# Altium schematic sheet TEST-MODULE.SchDoc
size A4
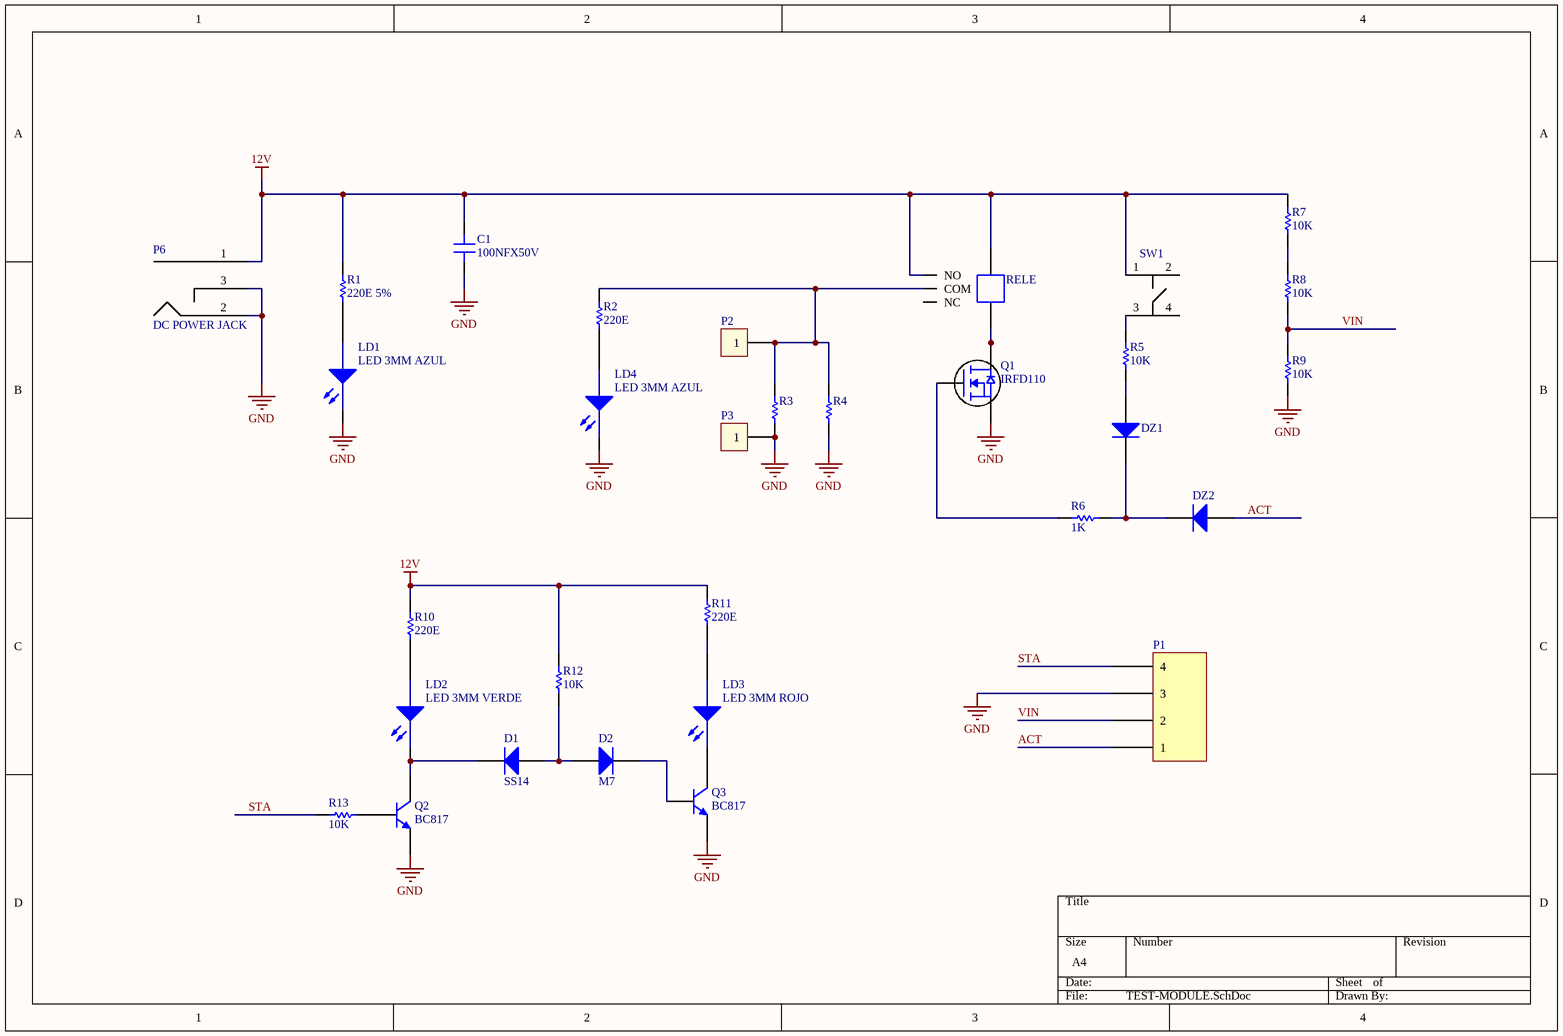
[diagram p0: TEST-MODULE.SchDoc]

## Parts
C1  100NFX50V  [CAP.SMD.0805]
D1  SS14  [Diode-SMD-SMA]
D2  M7  [Diode-SMD-SMA]
DZ1  M7 DIODO 1A 1000V SMD-SMA (1N4007) XYG  [Diode-SMD-SMA]  (value not drawn)
DZ2  M7 DIODO 1A 1000V SMD-SMA (1N4007) XYG  [Diode-SMD-SMA]  (value not drawn)
LD1  LED 3MM AZUL  [LED 3MM AZUL]
LD2  LED 3MM VERDE  [LED 3MM VERDE]
LD3  LED 3MM ROJO  [LED 3MM ROJO]
LD4  LED 3MM AZUL  [LED 3MM AZUL]
P1  CONECTOR PWXXS MA-04 VERTICAL P=3.96MM PW0  [CONECTOR PWXXS MA-04 VERTICAL P=3.96MM]  (value not drawn)
P2  IDC-MA-THT-1X1-P2.54MM-L11  [IDC-MA-THT-1X1-P2.54MM-L11]  (value not drawn)
P3  IDC-MA-THT-1X1-P2.54MM-L11  [IDC-MA-THT-1X1-P2.54MM-L11]  (value not drawn)
P6  DC POWER JACK  [VAR-DC-JACK]
Q1  IRFD110  [TRA-IRFD110]
Q2  BC817  [NPN.SMD.SOT23]
Q3  BC817  [NPN.SMD.SOT23]
R1  220E 5%  [RES.SMD.221]
R2  220E  [RES.SMD.221]
R3  Resistencia Ceramica 15E 5% 15W SE15 RES.CEM  [RES-CERAMICA-15W]  (value not drawn)
R4  Resistencia Ceramica 15E 5% 15W SE15 RES.CEM  [RES-CERAMICA-15W]  (value not drawn)
R5  10K  [RES.SMD.103]
R6  1K  [RES.SMD.102]
R7  10K  [RES.SMD.103]
R8  10K  [RES.SMD.103]
R9  10K  [RES.SMD.103]
R10  220E  [RES.SMD.221]
R11  220E  [RES.SMD.221]
R12  10K  [RES.SMD.103]
R13  10K  [RES.SMD.103]
RELE  Relay simple inversor 5V 10A  [VAR-RELE-5V10A]  (value not drawn)
SW1  TACT-SWITCH  [TACT-SWITCH-THT-4C-06X06-4.3MM]  (value not drawn)

## Nets
12V: C1.2 P6.1 R1.2 R7.2 R10.2 R11.2 R12.2 RELE.2 RELE.4(NO) SW1.1
GND: C1.1 LD1.K(KB) LD4.K(KB) P1.3 P3.1 P6.2 P6.3 Q1.4 Q2.2(E) Q3.2(E) R3.1 R4.1 R9.1
ACT: DZ2.A P1.1
STA: P1.4 R13.1
VIN: P1.2 R8.1 R9.2
NetD1_A: D1.A D2.A R12.1
NetD1_K: D1.K LD2.K(KB) Q2.3(C)
NetD2_K: D2.K Q3.1(B)
NetDZ1_A: DZ1.A R5.1
NetDZ1_K: DZ1.K DZ2.K R6.2
NetLD1_A: LD1.A(AB) R1.1
NetLD2_A: LD2.A(AB) R10.1
NetLD3_A: LD3.A(AB) R11.1
NetLD3_K: LD3.K(KB) Q3.3(C)
NetLD4_A: LD4.A(AB) R2.1
NetP2_1: P2.1 R2.2 R3.2 R4.2 RELE.3(COM)
NetQ1_1: Q1.1 Q1.2 RELE.1
NetQ1_3: Q1.3 R6.1
NetQ2_1: Q2.1(B) R13.2
NetR5_2: R5.2 SW1.3
NetR7_1: R7.1 R8.2

Not connected (* = marked no-connect by the designer): RELE 5(NC); SW1 2 4

## Library data of the parts
C1 = Capacitor 100NFX50V X7R 10% CER.MULT. SMD 0805: 100NFX50V X7R 10% CER.MULT. SMD 0805; COD. ELEMON: CA3279774; COD. FV: CE.CAP.0008
D1 D2 = Diodo M7 DIODO 1A 1000V SMD-SMA (1N4007) XYG: M7 DIODO 1A 1000V SMD-SMA (1N4007) XYG; COD. ELEMON: DI1202221
DZ1 DZ2 = Diodo M7 DIODO 1A 1000V SMD-SMA (1N4007) XYG: COD. ELEMON: DI1202221
LD1 LD4 = LED 3MM AZUL WC SUPER BRILLO 1250mcd 30Âº 204-10SUBC/C470/S400-A6 PATAS 14MM: COD. ELEMON: OP1452620
LD2 = LED 3MM VERDE WC SUPER BRILLO 15000mcd 26Âº: COD. ELEMON: OP1452540
LD3 = LED 3MM ROJO WC SUPER BRILLO 2000mcd 26Âº: COD. ELEMON: OP1452500
P1 = CONECTOR PWXXS MA-04 VERTICAL P=3.96MM PW04S: COD. ELEMON: CO5052040; COD. FV: CE.CON.0013
P2 P3 = IDC-MA-THT-1X1-P2.54MM-L11: COD. ELEMON: CO496C20
P6 = DC POWER JACK 90 GRA. 2MM: COD. ELEMON: MC6691355
Q1 = Transistor MOSFET N IRFD110: COD. FV: CE.TRA.0003
Q2 Q3 = Transistor BC817-40 TRA.NPN 45V0.5A 0.25W SOT23: BC817-40 TRA.NPN 45V0.5A 0.25W SOT23; COD. ELEMON: TR1723020; COD. FV: CE.TRA.0002
R1 R2 R10 R11 = Resistencia 220E 5% 0805 1/8W: 220E 5% 0805 1/8W RES.SMD; COD. ELEMON: RS3896145
R3 R4 = Resistencia Ceramica 15E 5% 15W SE15 RES.CEM: COD. ELEMON: RS4176075
R5 R7-R9 R12 R13 = Resistencia 10K 5% 0805 1/8W: 10K 5% 0805 1/8W RES.SMD; COD. ELEMON: RS3896245; COD. FV: CE.RES.0014
R6 = Resistencia 1K 5% 0805 1/8W: 1K 5% 0805 1/8W RES.SMD; COD. ELEMON: RS3896185; COD. FV: CE.RES.0012
RELE = VAR-RELE-5V Relay simple inversor 5V 10A: COD. SYC: NT73-05
SW1 = TACT-SWITCH-THT-4C-06X06(4.3MM)-JIANFU: COD. ELEMON: SW5702091